# Altium project passeger.PrjPcb
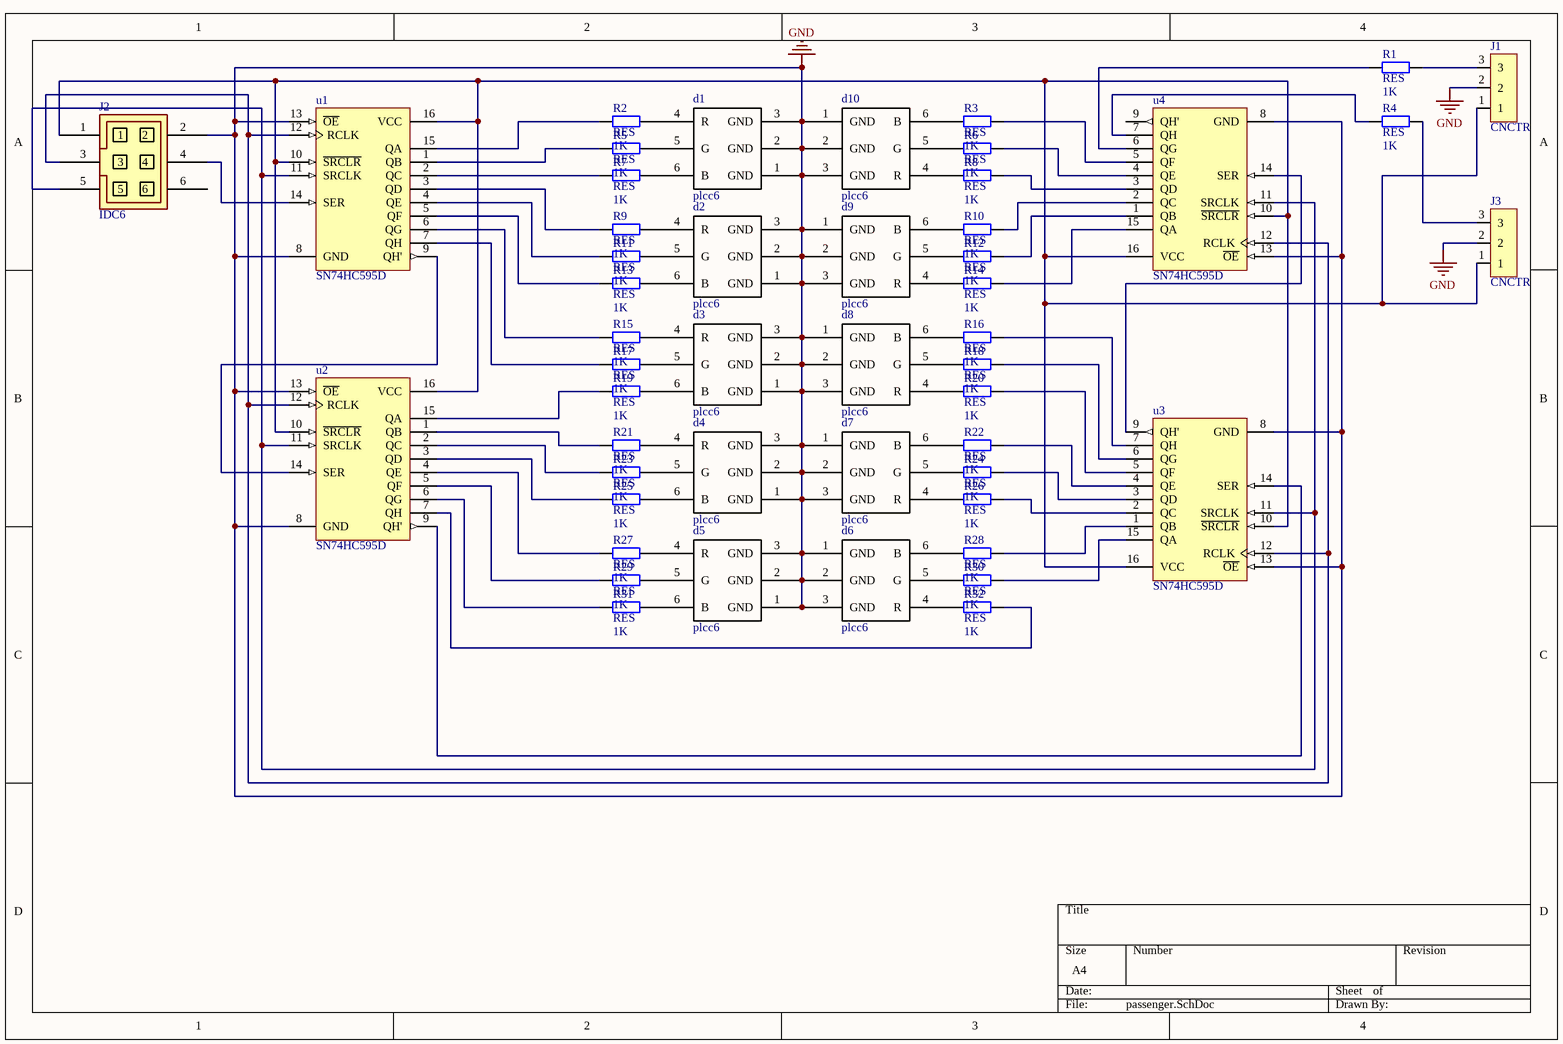
[diagram p0: passenger.SchDoc]
1 sheet, 49 parts. Net scope: global (net labels, ports and power ports of the same name join across sheets).
Board file: Passenger.PcbDoc

## Sheet passenger.SchDoc
size A4

### Parts
d1  plcc6  [plcc6]
d2  plcc6  [plcc6]
d3  plcc6  [plcc6]
d4  plcc6  [plcc6]
d5  plcc6  [plcc6]
d6  plcc6  [plcc6]
d7  plcc6  [plcc6]
d8  plcc6  [plcc6]
d9  plcc6  [plcc6]
d10  plcc6  [plcc6]
J1  CNCTR  [CNCTR_1X3]
J2  IDC6  [IDC6]
J3  CNCTR  [CNCTR_1X3]
R1  RES  value 1K  [RESC1608X06M]
R2  RES  value 1K  [RESC1608X06M]
R3  RES  value 1K  [RESC1608X06M]
R4  RES  value 1K  [RESC1608X06M]
R5  RES  value 1K  [RESC1608X06M]
R6  RES  value 1K  [RESC1608X06M]
R7  RES  value 1K  [RESC1608X06M]
R8  RES  value 1K  [RESC1608X06M]
R9  RES  value 1K  [RESC1608X06M]
R10  RES  value 1K  [RESC1608X06M]
R11  RES  value 1K  [RESC1608X06M]
R12  RES  value 1K  [RESC1608X06M]
R13  RES  value 1K  [RESC1608X06M]
R14  RES  value 1K  [RESC1608X06M]
R15  RES  value 1K  [RESC1608X06M]
R16  RES  value 1K  [RESC1608X06M]
R17  RES  value 1K  [RESC1608X06M]
R18  RES  value 1K  [RESC1608X06M]
R19  RES  value 1K  [RESC1608X06M]
R20  RES  value 1K  [RESC1608X06M]
R21  RES  value 1K  [RESC1608X06M]
R22  RES  value 1K  [RESC1608X06M]
R23  RES  value 1K  [RESC1608X06M]
R24  RES  value 1K  [RESC1608X06M]
R25  RES  value 1K  [RESC1608X06M]
R26  RES  value 1K  [RESC1608X06M]
R27  RES  value 1K  [RESC1608X06M]
R28  RES  value 1K  [RESC1608X06M]
R29  RES  value 1K  [RESC1608X06M]
R30  RES  value 1K  [RESC1608X06M]
R31  RES  value 1K  [RESC1608X06M]
R32  RES  value 1K  [RESC1608X06M]
u1  SN74HC595D  [D016_N]
u2  SN74HC595D  [D016_N]
u3  SN74HC595D  [D016_N]
u4  SN74HC595D  [D016_N]

### Nets
GND: d1.1(GND) d1.2(GND) d1.3(GND) d2.1(GND) d2.2(GND) d2.3(GND) d3.1(GND) d3.2(GND) d3.3(GND) d4.1(GND) d4.2(GND) d4.3(GND) d5.1(GND) d5.2(GND) d5.3(GND) d6.1(GND) d6.2(GND) d6.3(GND) d7.1(GND) d7.2(GND) d7.3(GND) d8.1(GND) d8.2(GND) d8.3(GND) d9.1(GND) d9.2(GND) d9.3(GND) d10.1(GND) d10.2(GND) d10.3(GND) J1.2 J2.2 J3.2 u1.8(GND) u1.13(~{OE}) u2.8(GND) u2.13(~{OE}) u3.8(GND) u3.13(~{OE}) u4.8(GND) u4.13(~{OE})
Netd1_4: d1.4(R) R2.2
Netd1_5: d1.5(G) R5.2
Netd1_6: d1.6(B) R7.2
Netd2_4: d2.4(R) R9.2
Netd2_5: d2.5(G) R11.2
Netd2_6: d2.6(B) R13.2
Netd3_4: d3.4(R) R15.2
Netd3_5: d3.5(G) R17.2
Netd3_6: d3.6(B) R19.2
Netd4_4: d4.4(R) R21.2
Netd4_5: d4.5(G) R23.2
Netd4_6: d4.6(B) R25.2
Netd5_4: d5.4(R) R27.2
Netd5_5: d5.5(G) R29.2
Netd5_6: d5.6(B) R31.2
Netd6_4: d6.4(R) R32.1
Netd6_5: d6.5(G) R30.1
Netd6_6: d6.6(B) R28.1
Netd7_4: d7.4(R) R26.1
Netd7_5: d7.5(G) R24.1
Netd7_6: d7.6(B) R22.1
Netd8_4: d8.4(R) R20.1
Netd8_5: d8.5(G) R18.1
Netd8_6: d8.6(B) R16.1
Netd9_4: d9.4(R) R14.1
Netd9_5: d9.5(G) R12.1
Netd9_6: d9.6(B) R10.1
Netd10_4: d10.4(R) R8.1
Netd10_5: d10.5(G) R6.1
Netd10_6: d10.6(B) R3.1
NetJ1_1: J1.1 J2.1 J3.1 u1.10(~{SRCLR}) u1.16(VCC) u2.10(~{SRCLR}) u2.16(VCC) u3.10(~{SRCLR}) u3.16(VCC) u4.10(~{SRCLR}) u4.16(VCC)
NetJ1_3: J1.3 R1.2
NetJ2_3: J2.3 u1.12(RCLK) u2.12(RCLK) u3.12(RCLK) u4.12(RCLK)
NetJ2_4: J2.4 u1.14(SER)
NetJ2_5: J2.5 u1.11(SRCLK) u2.11(SRCLK) u3.11(SRCLK) u4.11(SRCLK)
NetJ3_3: J3.3 R4.2
NetR1_1: R1.1 u4.6(QG)
NetR2_1: R2.1 u1.15(QA)
NetR3_2: R3.2 u4.5(QF)
NetR4_1: R4.1 u4.7(QH)
NetR5_1: R5.1 u1.1(QB)
NetR6_2: R6.2 u4.4(QE)
NetR7_1: R7.1 u1.2(QC)
NetR8_2: R8.2 u4.3(QD)
NetR9_1: R9.1 u1.3(QD)
NetR10_2: R10.2 u4.2(QC)
NetR11_1: R11.1 u1.4(QE)
NetR12_2: R12.2 u4.1(QB)
NetR13_1: R13.1 u1.5(QF)
NetR14_2: R14.2 u4.15(QA)
NetR15_1: R15.1 u1.6(QG)
NetR16_2: R16.2 u3.7(QH)
NetR17_1: R17.1 u1.7(QH)
NetR18_2: R18.2 u3.6(QG)
NetR19_1: R19.1 u2.15(QA)
NetR20_2: R20.2 u3.5(QF)
NetR21_1: R21.1 u2.1(QB)
NetR22_2: R22.2 u3.4(QE)
NetR23_1: R23.1 u2.2(QC)
NetR24_2: R24.2 u3.3(QD)
NetR25_1: R25.1 u2.3(QD)
NetR26_2: R26.2 u3.2(QC)
NetR27_1: R27.1 u2.4(QE)
NetR28_2: R28.2 u3.1(QB)
NetR29_1: R29.1 u2.5(QF)
NetR30_2: R30.2 u3.15(QA)
NetR31_1: R31.1 u2.6(QG)
NetR32_2: R32.2 u2.7(QH)
Netu1_9: u1.9(QH') u2.14(SER)
Netu2_9: u2.9(QH') u3.14(SER)
Netu3_9: u3.9(QH') u4.14(SER)

Not connected (* = marked no-connect by the designer): J2 6; u4 9(QH')

### Library data of the parts
J1 J3 = Connector: 3pin connector
J2 = IDC6: 6pin IDC connector
R1-R32 = RES: Resistor; Published: 8-Jun-2000; LatestRevisionDate: 17-Jul-2002; LatestRevisionNote: Re-released for DXP Platform.; PackageReference: AXIAL-0.4; Publisher: Altium Limited; PackageDescription: Axial Device, Thru-Hole; 2 Leads; 0.4 in Pin Spacing
u1-u4 = SN74HC595D: 8-Bit Shift Register with 3-State Output Registers; Published: 8-Jun-2000; LatestRevisionDate: 13-Apr-2006; LatestRevisionNote: IPC-7351 Footprint Added.; DatasheetVersion: May-1997; PackageVersion: Jan-1998; PackageReference: D016; Publisher: Altium Limited; PackageDescription: 16-Pin Small Outline Integrated Circuit 1.27 mm Pitch; Code_IPC: SOIC127P600-16; ComponentLink1Description: Manufacturer Link; ComponentLink1URL: http://www.ti.com/; ComponentLink2Description: Datasheet; ComponentLink2URL: http://www-s.ti.com/sc/ds/sn74hc595.pdf